# Altium project Power Distribution Board.PrjPcb
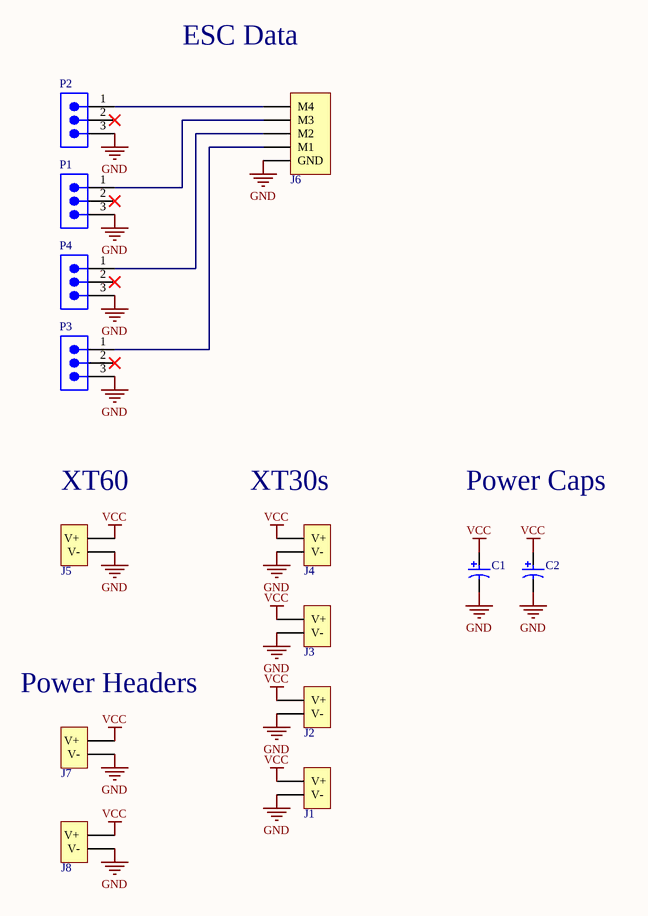
[diagram p0: PDB.SchDoc]
1 sheet, 14 parts. Net scope: global (net labels, ports and power ports of the same name join across sheets).
Board file: PDB.PcbDoc

## Sheet PDB.SchDoc: Frog PDB
size Letter; CompanyName: NUAV; Organization: NUAV; DocumentNumber: 1; Revision: AA; SheetNumber: 1; SheetTotal: 1

### Parts
C1  ECA-1JHG471  [CAPPR65-500-2000X1250X2200]  (value not drawn)
C2  ECA-1JHG471  [CAPPR65-500-2000X1250X2200]  (value not drawn)
J1  XT30PB-M  [XT30PB-M]  (value not drawn)
J2  XT30PB-M  [XT30PB-M]  (value not drawn)
J3  XT30PB-M  [XT30PB-M]  (value not drawn)
J4  XT30PB-M  [XT30PB-M]  (value not drawn)
J5  xt60-M  [xt60-m]  (value not drawn)
J6  motor to pixhawk conn  [motor to pixhawk headers]  (value not drawn)
J7  power header  [power header]  (value not drawn)
J8  power header  [power header]  (value not drawn)
P1  TSW-103-08-T-S-RA  [SMTC-TSW-103-08-X-S-RA]  (value not drawn)
P2  TSW-103-08-T-S-RA  [SMTC-TSW-103-08-X-S-RA]  (value not drawn)
P3  TSW-103-08-T-S-RA  [SMTC-TSW-103-08-X-S-RA]  (value not drawn)
P4  TSW-103-08-T-S-RA  [SMTC-TSW-103-08-X-S-RA]  (value not drawn)

### Nets
GND: C1.2 C2.2 J1.0(V-) J2.0(V-) J3.0(V-) J4.0(V-) J5.1(V-) J6.0(GND) J7.0(V-) J8.0(V-) P1.3 P2.3 P3.3 P4.3
VCC: C1.1 C2.1 J1.1(V+) J2.1(V+) J3.1(V+) J4.1(V+) J5.2(V+) J7.1(V+) J8.1(V+)
NetJ6_1: J6.1(M1) P3.1
NetJ6_2: J6.2(M2) P4.1
NetJ6_3: J6.3(M3) P1.1
NetJ6_4: J6.4(M4) P2.1

Not connected (* = marked no-connect by the designer): P1 2*; P2 2*; P3 2*; P4 2*

### Notes on the sheet
- ESC Data
- (near J5) XT60
- (near J4) XT30s
- Power Caps
- (near J7) Power Headers
- Title
- Size:
- Date:
- Letter
- Number:
- Time:
- Revision:
- Sheet
- of
- File:

### Library data of the parts
C1 C2 = CMP-1665-00014-4: Aluminum Electrolytic Capacitor (Radial Lead Type), 470 uF, 63 V, -55 to 105 degC, 2-Pin THD, RoHS, Bulk; Manufacturer: Panasonic; Voltage Rating: 63 V; Lead Pitch: 5 mm; ComponentLink2URL: http://industrial.panasonic.com/cdbs/www-data/pdf/RDF0000/ABA0000C1038.pdf; DatasheetVersion: 03/2016; ComponentLink1URL: http://www.panasonic.com/; Mount: Through Hole; Max Operating Temperature: 105 degC; Pins: 2; Packaging: Bulk; ComponentLink1Description: Manufacturer URL; Height: 20 mm; REACH SVHC: No SVHC; RoHSCompliant: true; Mounting Technology: Through Hole; PackageDescription: 2-Pin Through Hole Device, Dia 12.5 mm, Body Length 20 mm; Package Quantity: 200; Min Operating Temperature: -55 degC; PackageReference: Radial; ComponentLink2Description: Datasheet; Length: 20 mm
P1-P4 = CMP-1024-00346-1: 0.025" SQ Post Header, Through-hole, Right Angle, -55 to 105 degC, 2.54 mm Pitch, 3-Pin, Male, RoHS; Manufacturer: Samtec; Pitch: 2.54 mm; DatasheetVersion: F-214; ComponentLink1URL: http://www.samtec.com; PackageReference: TSW-103-08-X-S-RA; ComponentLink3Description: Package Specification; ComponentLink2Description: Datasheet; ComponentLink1Description: Manufacturer URL; PackageVersion: DM, 8/1988; ComponentLink2URL: http://www.samtec.com/documents/webfiles/pdf/TSW_TH.PDF; PartNumber: TSW-103-08-T-S-RA; ComponentLink3URL: http://www.samtec.com/documents/webfiles/cpdf/TSW-XXX-XX-XXX-X-XX-XXX-MKT.pdf; Temperature Range: -55 to 105 degC; Mounting Technology: Through-hole; RoHS: True; PackageDescription: .025[0.64] SQ. Post Terminal Strip Assembly; Orientation: Right Angle
J1-J4 = XT30PB-M: ComponentLink1Description: Supplier; ComponentLink1URL: http://shop.smc-powers.com/XT30UPB-M.html?manufacturer_id=13&page=4